# Altium schematic sheet Motor Drive Input.SchDoc
size A4; SheetNumber: 8; SheetTotal: 8
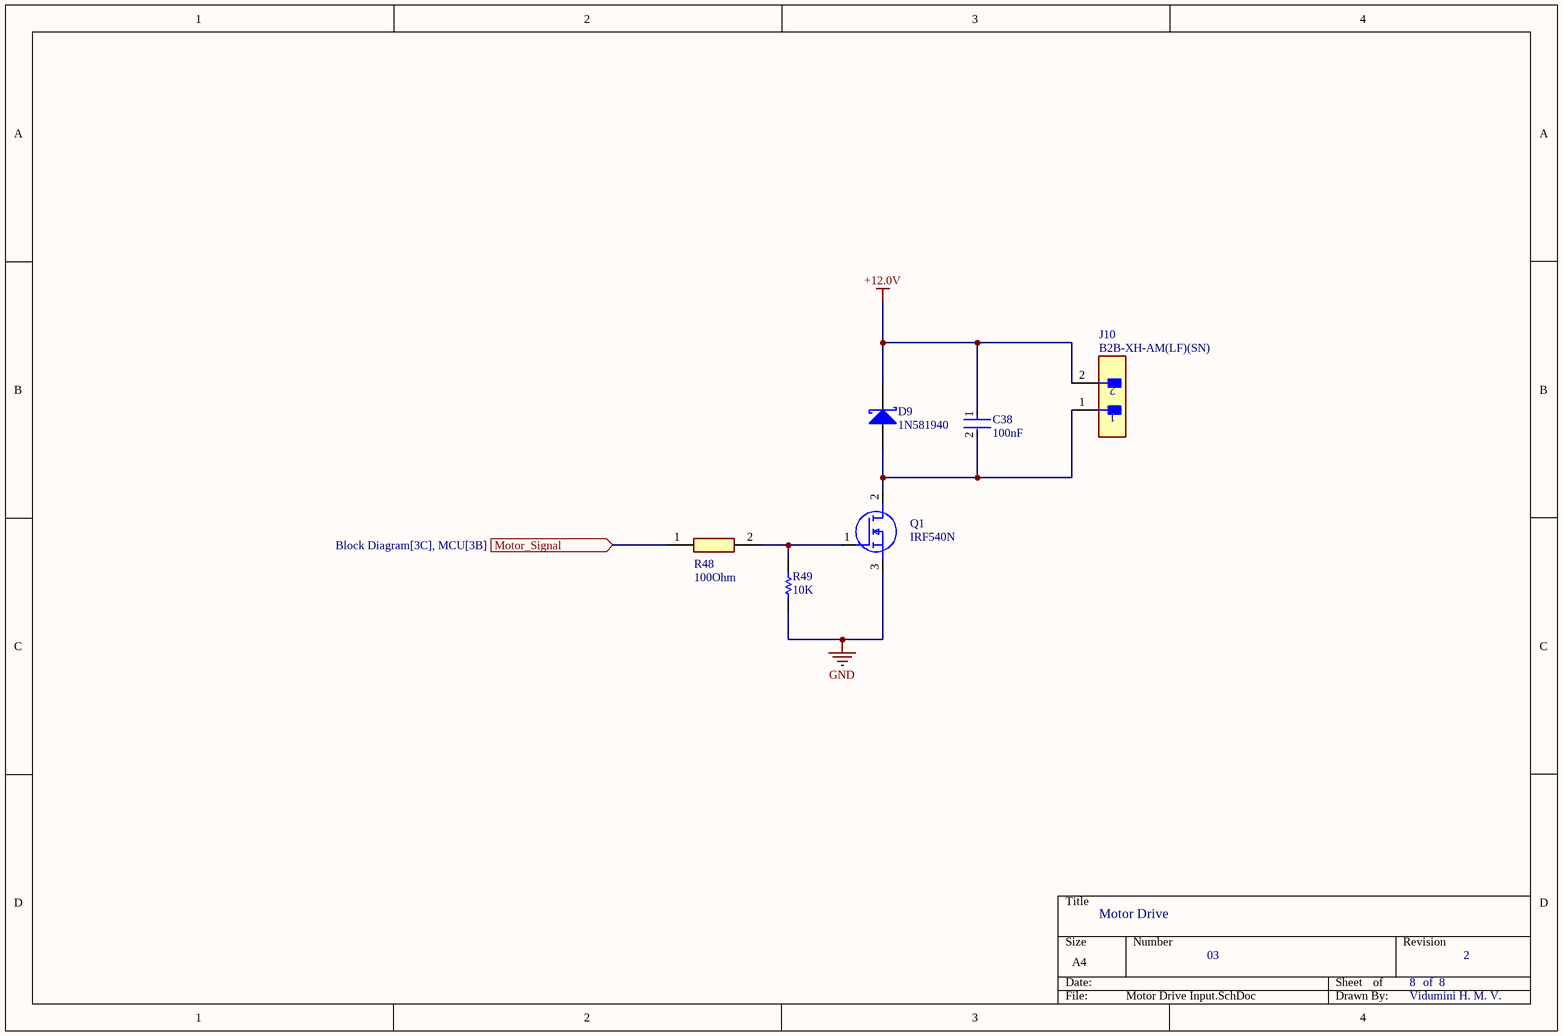
[diagram p0: Motor Drive Input.SchDoc]

## Parts
C38  100nF  [FP-1206-L_3_2_0_2-W_1_6_0-IPC_C]
D9  1N581940  [DIOD-DO-41-P-2]
J10  B2B-XH-AM(LF)(SN)  [FP-B2B-XH-AM_LF_SN-MFG]
Q1  IRF540N  [TO254P469X1042X1967-3P]
R48  100Ohm  [RESC2013X65N]
R49  10K  [RESC3116X65X40ML10T20]

## Ports
Motor_Signal (in, see Block Diagram[3C], MCU[3B])

## Nets
+12.0V: C38.1 D9.2(K) J10.2
GND: Q1.3(S) R49.1
Motor_Signal: R48.1 ; port Motor_Signal
NetC38_2: C38.2 D9.1(A) J10.1 Q1.2(D)
NetQ1_1: Q1.1(G) R48.2 R49.2

## Notes on the sheet
- Motor Drive
- 03
- 8
- of  8
- 2
- Vidumini H. M. V.

## Library data of the parts
C38 = CMP-04427-013576-1: General Purpose Ceramic Capacitor, 1206, 100nF, 5%, X7R, 15%, 100V; Max Operating Temperature: 125°C; Depth: 1.6mm; Package Quantity: 1; Thickness: 0.05inch; Number of Pins: 2; Height: 1.27mm; Voltage Rating (DC): 100V; Radiation Hardening: No; Termination: SMD/SMT; Construction: Flat; REACH SVHC: No SVHC; Case/Package: 1206; Case Code (Imperial): 1206; Tolerance: 5%; Width: 0.063inch; Voltage: 100V; Packaging: Tape and Reel; Voltage Rating: 100V; Case Code (Metric): 3216; Capacitance: 100nF; Min Operating Temperature: -55°C; Length: 3.2mm; Dielectric: X7R; Mount: Surface Mount; Dielectric Material: Ceramic; Contact Plating: Tin; RoHS Compliant: Yes; Lead Free: Lead Free; Series: -
D9 = CMP-2000-05521-1: Schottky Barrier Rectifier, 1 A, 20 V, -65 to 125 degC, 2-Pin DO-41, RoHS, Tape and Reel; Manufacturer: DiodesIncorporated; Vrrm - Repetitive Reverse Voltage: 20V; If - Forward Current: 1A; Configuration: Single; Unit Weight: 0.010582oz; Type: SchottkyDiode; Ifsm - Forward Surge Current: 25A; Vf - Forward Voltage: 0.75Vat3A; Ir - Reverse Current: 1000uA; Technology: Si; Length: 5.21mm; Product: SchottkyRectifiers; Package Reference: DO-41-P-2; Package / Case: DO-41; Datasheet URL: http://www.diodes.com/_files/datasheets/ds23001.pdf; Operating Temperature Range: -65Cto+125C; Mounting Style: ThroughHole; Manufacturer URL: http://www.diodes.com/; Series: 1N58; Minimum Operating Temperature: -65C; Height: 2.72mm; Brand: DiodesIncorporated; Maximum Operating Temperature: +125C; Datasheet Version: Rev. 8-2, 05/2009; Factory Pack Quantity: 5000; Width: 2.72mm; RoHS: True; Product Category: SchottkyDiodes&Rectifiers; Package Description: 2-Pin Through Hole Device, Body 4.635 x 2.36 mm, Pin Spacing 7.85 mm; Packaging: Reel; Termination Style: ThroughHole; Mounting Technology: ThroughHole
J10 = CMP-17439-000037-1: CONN HEADER VERT 2POS 2.5MM; Max Voltage Rating (AC): 250V; Connector Type: Male Pin; Contact Resistance: 20mR; Max Current Rating: 3A; Number of Positions: 2; Series: XH; Contact Material: Brass; Mount: Through Hole; Housing Material: Polyamide; Contact Plating: Tin; Termination: Solder; Max Operating Temperature: 85°C; Depth: 5.75mm; Packaging: Bulk; Min Operating Temperature: -25°C; Contact Type: Male Pin; Color: Green; Pitch: 2.5mm; Length: 7.4mm; Lead Free: Lead Free; Number of Rows: 1; Fastening Type: Detent; Housing Color: White; Orientation: Straight
Q1 = IRF540N: MOSFET (N-Channel); Manufacturer_Name: Infineon; Datasheet Link: http://uk.rs-online.com/web/p/products/3713068; Height: 4.69mm; Manufacturer_Part_Number: IRF540N
R48 = 0805W8F1000T5E: Resistor; Manufacturer_Name: UNI-ROYAL(Uniroyal Elec); Datasheet Link: https://datasheet.lcsc.com/szlcsc/Uniroyal-Elec-0805W8F1000T5E_C17408.pdf; Height: 0.65mm; Manufacturer_Part_Number: 0805W8F1000T5E
R49 = CMP-1014-00623-2: Chip Resistor, 10 KOhm, +/- 1%, 0.25 W, -55 to 155 degC, 1206 (3216 Metric), RoHS, Tape and Reel; Manufacturer: Yageo; Voltage Rating: 200V; Resistance: 10KOhm; Temperature Coefficient: 100ppm/degreesC; Power Rating: 250mW; Packaging: TapeandReel; Termination: SMD/SMT; REACH SVHC: Unknown; Tolerance: 1%; Height: 0.55mm; Composition: ThickFilm; Max Operating Temperature: 155degC; Datasheet Version: Rev. 5, 10/2016; Lead Free: LeadFree; Case Code (Metric): 3216; Depth: 1.6mm; Package Quantity: 5000; RoHSCompliant: true; Military Standard: Not; Case/Package: 1206; Case Code (Imperial): 1206; Min Operating Temperature: -55degC; Datasheet URL: http://www.yageo.com/NewPortal/yageodocoutput?fileName=/pdf/R-Chip/PYu-RC_Group_51_RoHS_L_5.pdf; Length: 3.1mm; Manufacturer URL: http://www.yageo.com/; Package Reference: 1206.0; Width: 1.6mm; Package Description: 2-Pin Surface Mount Device, Body 3.1 x 1.6 mm